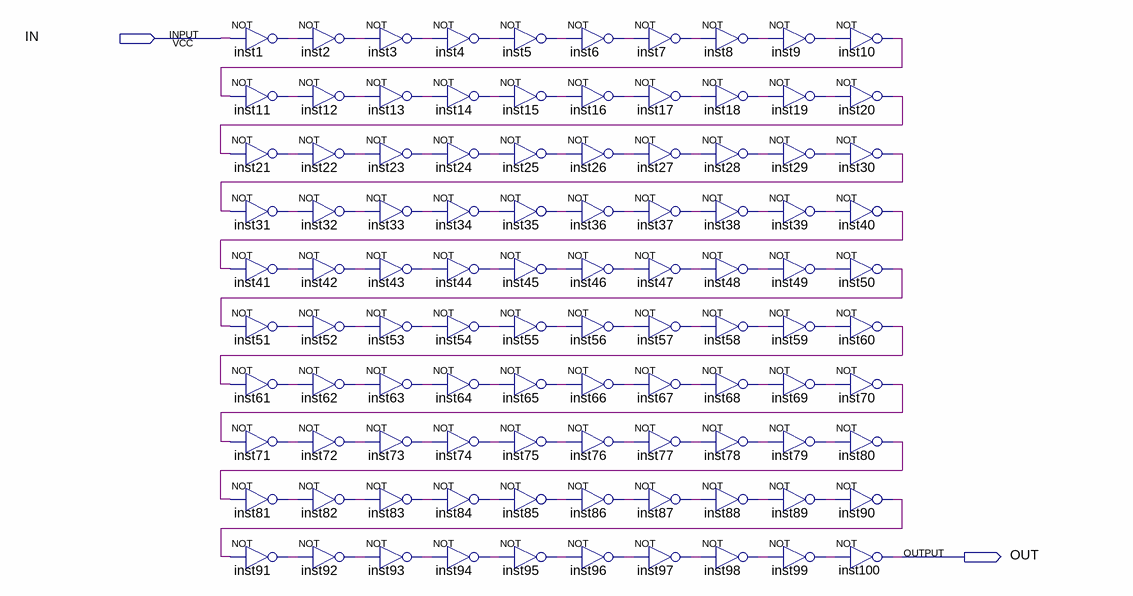
[diagram p0: schematic sheet]
// Quartus schematic invertors100.bdf as structural Verilog: 100 symbols, 2 pins
module invertors100 (
  input  IN,
  output OUT
);

  wire inst1_out, inst2_out, inst3_out, inst4_out, inst5_out, inst6_out, inst7_out, inst8_out, inst9_out,
       inst10_out, inst11_out, inst12_out, inst13_out, inst14_out, inst15_out, inst16_out, inst17_out,
       inst18_out, inst19_out, inst20_out, inst21_out, inst22_out, inst23_out, inst24_out, inst25_out,
       inst26_out, inst27_out, inst28_out, inst29_out, inst30_out, inst31_out, inst32_out, inst33_out,
       inst34_out, inst35_out, inst36_out, inst37_out, inst38_out, inst39_out, inst40_out, inst41_out,
       inst42_out, inst43_out, inst44_out, inst45_out, inst46_out, inst47_out, inst48_out, inst49_out,
       inst50_out, inst51_out, inst52_out, inst53_out, inst54_out, inst55_out, inst56_out, inst57_out,
       inst58_out, inst59_out, inst60_out, inst61_out, inst62_out, inst63_out, inst64_out, inst65_out,
       inst66_out, inst67_out, inst68_out, inst69_out, inst70_out, inst71_out, inst72_out, inst73_out,
       inst74_out, inst75_out, inst76_out, inst77_out, inst78_out, inst79_out, inst80_out, inst81_out,
       inst82_out, inst83_out, inst84_out, inst85_out, inst86_out, inst87_out, inst88_out, inst89_out,
       inst90_out, inst91_out, inst92_out, inst93_out, inst94_out, inst95_out, inst96_out, inst97_out,
       inst98_out, inst99_out;

  not inst1 (inst1_out, IN);
  not inst11 (inst11_out, inst10_out);
  not inst21 (inst21_out, inst20_out);
  not inst31 (inst31_out, inst30_out);
  not inst41 (inst41_out, inst40_out);
  not inst51 (inst51_out, inst50_out);
  not inst61 (inst61_out, inst60_out);
  not inst71 (inst71_out, inst70_out);
  not inst81 (inst81_out, inst80_out);
  not inst91 (inst91_out, inst90_out);
  not inst2 (inst2_out, inst1_out);
  not inst3 (inst3_out, inst2_out);
  not inst12 (inst12_out, inst11_out);
  not inst13 (inst13_out, inst12_out);
  not inst22 (inst22_out, inst21_out);
  not inst23 (inst23_out, inst22_out);
  not inst32 (inst32_out, inst31_out);
  not inst33 (inst33_out, inst32_out);
  not inst42 (inst42_out, inst41_out);
  not inst43 (inst43_out, inst42_out);
  not inst52 (inst52_out, inst51_out);
  not inst53 (inst53_out, inst52_out);
  not inst62 (inst62_out, inst61_out);
  not inst63 (inst63_out, inst62_out);
  not inst72 (inst72_out, inst71_out);
  not inst73 (inst73_out, inst72_out);
  not inst82 (inst82_out, inst81_out);
  not inst83 (inst83_out, inst82_out);
  not inst92 (inst92_out, inst91_out);
  not inst93 (inst93_out, inst92_out);
  not inst4 (inst4_out, inst3_out);
  not inst14 (inst14_out, inst13_out);
  not inst24 (inst24_out, inst23_out);
  not inst34 (inst34_out, inst33_out);
  not inst44 (inst44_out, inst43_out);
  not inst54 (inst54_out, inst53_out);
  not inst64 (inst64_out, inst63_out);
  not inst74 (inst74_out, inst73_out);
  not inst84 (inst84_out, inst83_out);
  not inst94 (inst94_out, inst93_out);
  not inst5 (inst5_out, inst4_out);
  not inst15 (inst15_out, inst14_out);
  not inst25 (inst25_out, inst24_out);
  not inst35 (inst35_out, inst34_out);
  not inst45 (inst45_out, inst44_out);
  not inst55 (inst55_out, inst54_out);
  not inst65 (inst65_out, inst64_out);
  not inst75 (inst75_out, inst74_out);
  not inst85 (inst85_out, inst84_out);
  not inst95 (inst95_out, inst94_out);
  not inst6 (inst6_out, inst5_out);
  not inst16 (inst16_out, inst15_out);
  not inst26 (inst26_out, inst25_out);
  not inst36 (inst36_out, inst35_out);
  not inst46 (inst46_out, inst45_out);
  not inst56 (inst56_out, inst55_out);
  not inst66 (inst66_out, inst65_out);
  not inst76 (inst76_out, inst75_out);
  not inst86 (inst86_out, inst85_out);
  not inst96 (inst96_out, inst95_out);
  not inst7 (inst7_out, inst6_out);
  not inst17 (inst17_out, inst16_out);
  not inst27 (inst27_out, inst26_out);
  not inst37 (inst37_out, inst36_out);
  not inst47 (inst47_out, inst46_out);
  not inst57 (inst57_out, inst56_out);
  not inst67 (inst67_out, inst66_out);
  not inst77 (inst77_out, inst76_out);
  not inst87 (inst87_out, inst86_out);
  not inst97 (inst97_out, inst96_out);
  not inst8 (inst8_out, inst7_out);
  not inst18 (inst18_out, inst17_out);
  not inst28 (inst28_out, inst27_out);
  not inst38 (inst38_out, inst37_out);
  not inst48 (inst48_out, inst47_out);
  not inst58 (inst58_out, inst57_out);
  not inst68 (inst68_out, inst67_out);
  not inst78 (inst78_out, inst77_out);
  not inst88 (inst88_out, inst87_out);
  not inst98 (inst98_out, inst97_out);
  not inst9 (inst9_out, inst8_out);
  not inst19 (inst19_out, inst18_out);
  not inst29 (inst29_out, inst28_out);
  not inst39 (inst39_out, inst38_out);
  not inst49 (inst49_out, inst48_out);
  not inst59 (inst59_out, inst58_out);
  not inst69 (inst69_out, inst68_out);
  not inst79 (inst79_out, inst78_out);
  not inst89 (inst89_out, inst88_out);
  not inst99 (inst99_out, inst98_out);
  not inst10 (inst10_out, inst9_out);
  not inst20 (inst20_out, inst19_out);
  not inst30 (inst30_out, inst29_out);
  not inst40 (inst40_out, inst39_out);
  not inst50 (inst50_out, inst49_out);
  not inst60 (inst60_out, inst59_out);
  not inst70 (inst70_out, inst69_out);
  not inst80 (inst80_out, inst79_out);
  not inst90 (inst90_out, inst89_out);
  not inst100 (OUT, inst99_out);
endmodule
